# EAGLE design hand_foot_forearm_leg_LED_stemma (EAGLE 7.3.0)
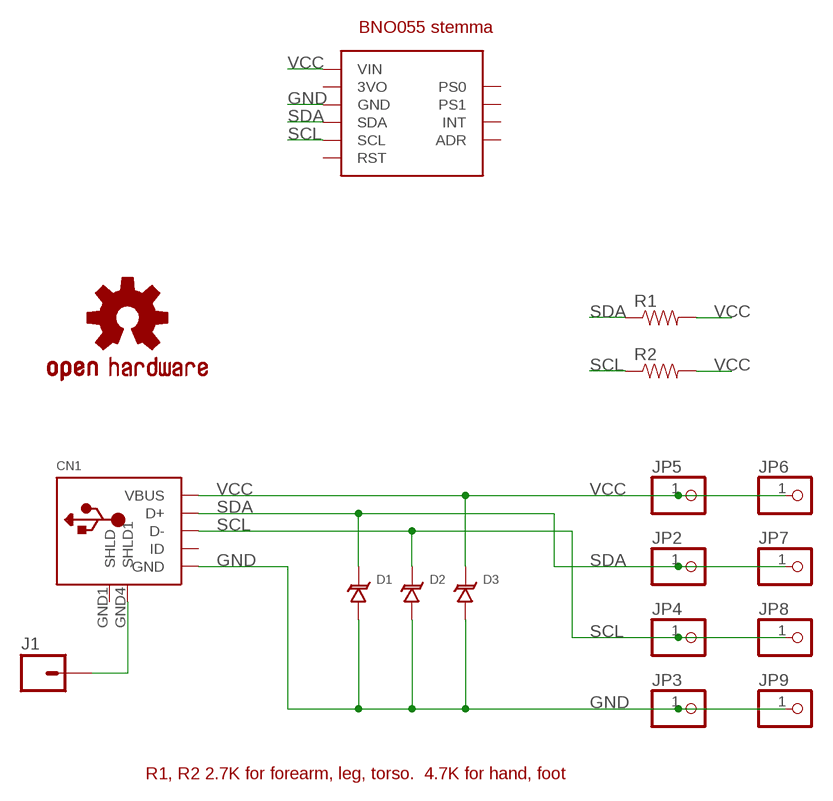
[diagram p0: schematic, sheet 1]

## Parts
CN1  USB  [USB-MINIB-THM-MOLEX_NOSLK]
D1  TVS_DIODE_SOD723  [SOD723]
D2  TVS_DIODE_SOD723  [SOD723]
D3  TVS_DIODE_SOD723  [SOD723]
J1  M01PTH  [1X01]
JP2  PINHD-1X1CB  [1X01-CLEANBIG]
JP3  PINHD-1X1CB  [1X01-CLEANBIG]
JP4  PINHD-1X1CB  [1X01-CLEANBIG]
JP5  PINHD-1X1CB  [1X01-CLEANBIG]
JP6  PINHD-1X1CB  [1X01-CLEANBIG]
JP7  PINHD-1X1CB  [1X01-CLEANBIG]
JP8  PINHD-1X1CB  [1X01-CLEANBIG]
JP9  PINHD-1X1CB  [1X01-CLEANBIG]
LOGO1  OSHW-LOGOS  [OSHW-LOGO-S]
R1  RESISTORAXIAL-0.3  [AXIAL-0.3]
R2  RESISTORAXIAL-0.3  [AXIAL-0.3]
U$2  BNO_055_STEMMA  [BNO_STEMMA]

## Nets
GND: CN1.GND D1.A D2.A D3.A JP3.1 JP9.1 U$2.GND
SCL: CN1.D- D2.C JP4.1 JP8.1 R2.P$1 U$2.SCL
SDA: CN1.D+ D1.C JP2.1 JP7.1 R1.P$1 U$2.SDA
SHIELD: CN1.GND4(SHLD1) J1.1
VCC: CN1.VBUS D3.C JP5.1 JP6.1 R1.P$2 R2.P$2 U$2.VIN
Unconnected: CN1.GND1(SHLD) CN1.ID U$2.3VO U$2.ADR U$2.INT U$2.PS0 U$2.PS1 U$2.RST

## Notes on the sheet
- BNO055 stemma
- R1, R2 2.7K for forearm, leg, torso.  4.7K for hand, foot

## Library data of the parts
CN1 = adafruit:USB: USB Connectors USBMINIB - Surface Mount Female Mini-B USB Connector 4UConnector: 06564 By microbuilder.eu Thru-hole RA Female Mini-B USB Connector 4UConnector: 18732 By ladyada.net
D1-D3 = little_fuse_tvs:TVS_DIODE_SOD723
J1 = SparkFun-Connectors:M01: Header 1 Standard 1-pin 0.1" header. Use with straight break away headers (SKU : PRT-00116), right angle break away headers (PRT-00553), swiss pins (PRT-00743), machine pins (PRT-00117), and female headers (PRT-00115). SMTSO-256-ET is a "flush mount" nut for a 4-40 screw. The older package used to be too tight, and did not allow it to sit properly thru the drill hit. The latest (0.165DIA) fits nice and snug.
JP2-JP9 = adafruit:PINHD-1X1: Pin header 1x1 for 0.1" spacing With round pins
LOGO1 = SparkFun-Aesthetics:OSHW-LOGO: Open Source Hardware Logo This logo indicates the piece of hardware it is found on incorporates a OSHW license and/or adheres to the definition of open source hardware found here: http://freedomdefined.org/OSHW
R1 R2 = SparkFun-Passives:RESISTOR: Resistor Basic schematic elements and footprints for 0603, 1206, and PTH resistors.
U$2 = skeleton:BNO_055_STEMMA

## Board
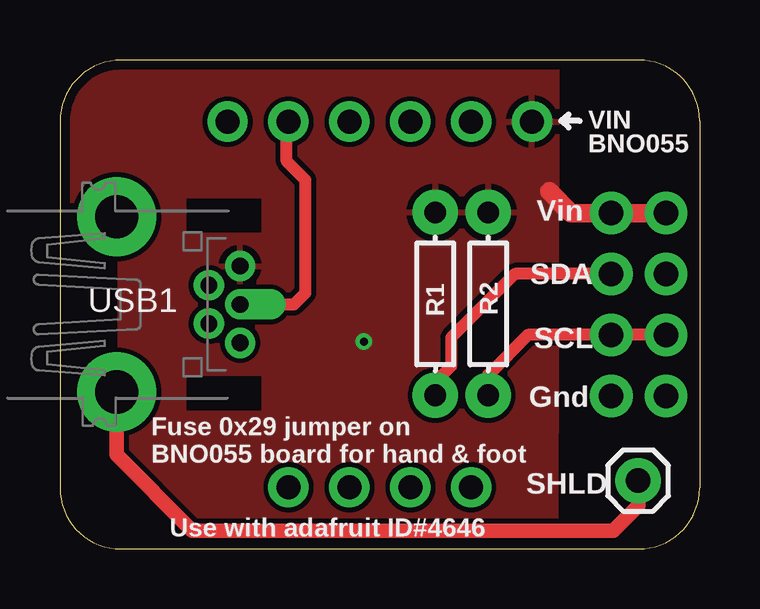
[diagram p1: board, top side]
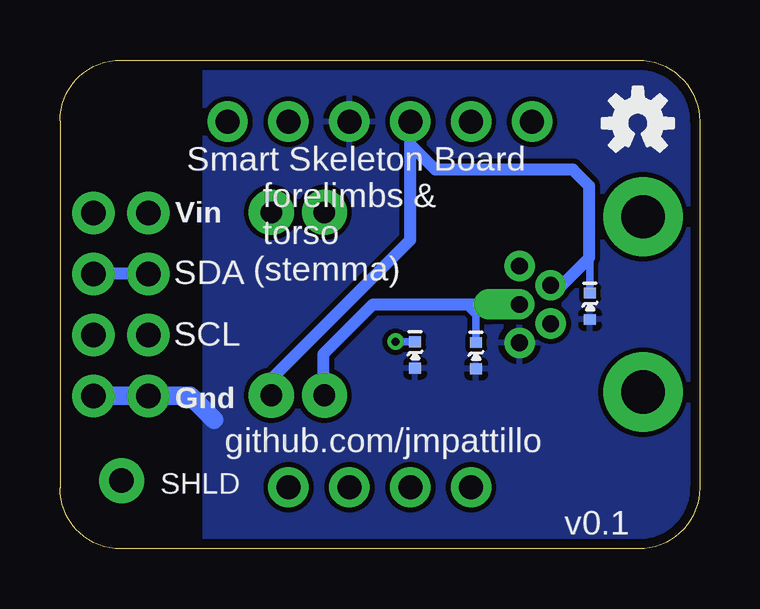
[diagram p2: board, bottom side, seen from below]

Size 26.67 x 20.37 mm. Coordinates in mm from the lower left corner, seen from the top.
Outline: 24.13,0 arc90 26.67,2.54 26.67,17.83 arc90 24.13,20.37 2.56,20.37 arc90 0,17.81 0,2.54 arc90 2.54,0 24.13,0
Copper layers (1*16): Top 0.0356mm / dielectric 1.5011mm / Bottom 0.0356mm
Design rules "LaenPCBOrder *": minimum track width 6mil, minimum drill 13mil, track to track 8mil, track to pad 7mil, pad to pad 8mil, via to via 8mil, smd to smd 8mil, copper to edge 15mil, drill to drill 6mil, minimum pad ring 7mil, minimum via ring 7mil, stop-mask expansion 3mil, vias tented up to drill 25mil, thermal gap 10mil

### Footprints (pad centres in the part's own frame; a part is rotated, then mirrored left to right if it is on the bottom)
USB-MINIB-THM-MOLEX_NOSLK = drill 0.7 pad 1.27 offset: D+ 0,9.72 | drill 0.7 pad 1.27: D- -0.8,8.42; GND 1.6,9.72; ID 0.8,8.42; VBUS -1.6,9.72 | drill 1.8 pad 3.302: GND1 -3.65,4.57; GND4 3.65,4.57
SOD723 = smd 0.5 x 0.45: A 0,-0.55; C 0,0.55
1X01 = drill 1.016 pad 1.88: 1 0,0
1X01-CLEANBIG = drill 1.016 pad 1.778: 1 0,0
AXIAL-0.3 = drill 0.9 pad 1.88: P$1 -3.81,0; P$2 3.81,0
BNO_STEMMA = drill 1 pad 1.676: 3VO -3.81,-8.89; ADR -1.27,6.35; GND -1.27,-8.89; INT -3.81,6.35; PS0 1.27,6.35; PS1 3.81,6.35; RST 6.35,-8.89; SCL 1.27,-8.89; SDA 3.81,-8.89; VIN -6.35,-8.89

### Placement (x,y rotation side)
CN1  -2.21,10.19 270 top
D1  9.32,8.05 0 bottom
D2  4.57,10.11 0 bottom
D3  11.86,8.08 0 bottom
J1  24.1,2.84 0 top
JP2  25.27,11.46 0 top
JP3  25.27,6.38 0 top
JP4  25.27,8.92 0 top
JP5  25.27,14 0 top
JP6  22.99,14 0 top
JP7  22.99,11.46 0 top
JP8  22.99,8.92 0 top
JP9  22.99,6.38 0 top
LOGO1  2.58,17.74 0 bottom
R1  15.65,10.21 90 top
R2  17.86,10.21 90 top
U$2  13.33,8.92 180 top

### Tracks (layer width: path | path; a pad name or v marks a point on that pad's centre or on a via)
GND
  Bottom 0.762: 20.24,5.38 21.23,6.38 JP9.1 JP3.1
  pour Bottom: -0.07,20.47 20.62,20.28 20.62,-0.2 -0.07,-0.01
SCL
  Top 0.508: JP4.1 JP8.1 19.51,8.92 17.86,7.26 R2.P$1
  Bottom 0.305: D2.C 4.57,12.12 4.6,12.14
  Bottom 0.508: CN1.D- 5.75,10.99 4.6,12.14 4.6,15.11 5.28,15.8 11.02,15.8 12.06,16.84 U$2.SCL 12.06,12.88 17.86,7.09 R2.P$1
SDA
  Top 0.508: JP7.1 18.97,11.46 16.31,8.79 16.31,7.62 15.65,6.96 R1.P$1 | CN1.D+ 9.75,10.19 10.24,10.67 10.24,15.37 9.45,16.15 9.45,17.73 U$2.SDA
  Bottom 0.305: D1.C 9.32,9.73 9.78,10.19
  Bottom 0.508: JP7.1 JP2.1 | CN1.D+ 9.78,10.19 13.61,10.19 15.7,8.1 15.7,6.45 R1.P$1
SHIELD
  Top 0.61: CN1.GND4 2.36,3.91 5.51,0.76 23.06,0.76 24.1,1.8 J1.1
VCC  (via drill 0.33)
  Top 0.762: 20.4,14.91 21.31,14 JP6.1 JP5.1
  Bottom 0.305: D3.C v12.67,8.64
  Bottom 0.406: 22.96,14.02 JP6.1
  pour Top: -0.12,20.4 20.71,20.21 20.66,-0.33 16,-0.08 16.03,-0.08 13.59,-0.08 13.51,-0.1 -0.09,-0.02

### Text on the board
tPlace: BNO055 | Fuse 0x29 jumper on / BNO055 board for hand & foot | Use with adafruit ID#4646
tNames: VIN | Vin | SDA | USB1 | SCL | Gnd | SHLD
bNames: Vin | Smart Skeleton Board / forelimbs & / torso / (stemma) | SDA | SCL | Gnd | github.com/jmpattillo | SHLD | v0.1